# EAGLE schematic compact-sensor (EAGLE 9.5.2)
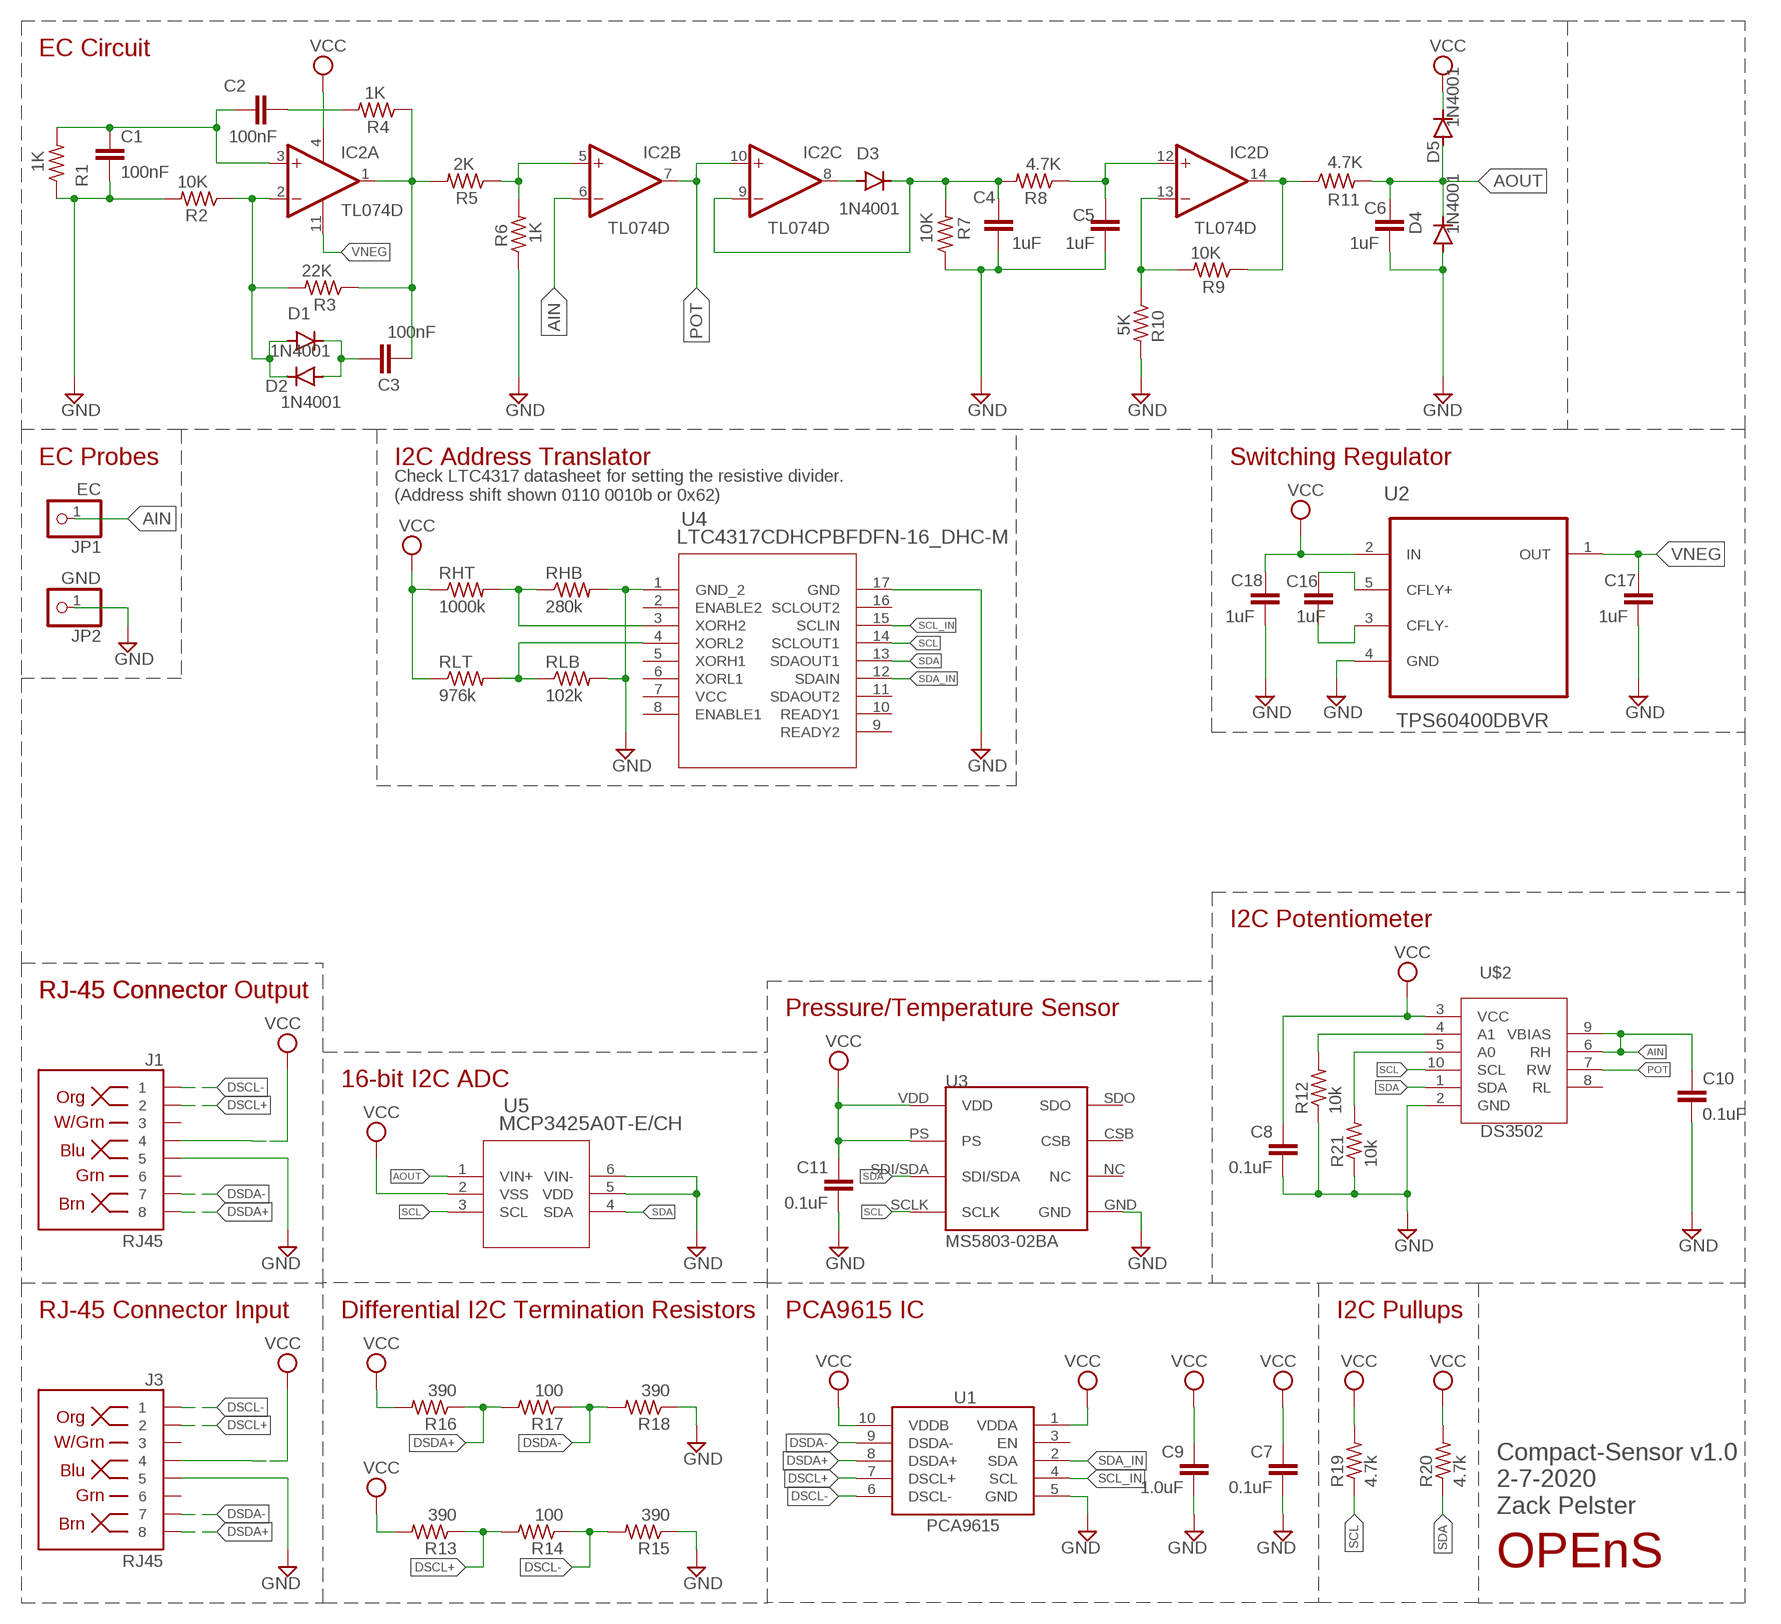
[diagram p0: schematic, sheet 1]

## Parts
C1  100nF  C-EUC0603  [C0603]
C2  100nF  C-EUC0603  [C0603]
C3  100nF  C-EUC0603  [C0603]
C4  1uF  C-EUC0603  [C0603]
C5  1uF  C-EUC0603  [C0603]
C6  1uF  C-EUC0603  [C0603]
C7  0.1uF  C-EUC0603  [C0603]
C8  0.1uF  C-EUC0603  [C0603]
C9  1.0uF  C-EUC0603  [C0603]
C10  0.1uF  C-EUC0603  [C0603]
C11  0.1uF  C-EUC0603  [C0603]
C16  1uF  C-EUC0603  [C0603]
C17  1uF  C-EUC0603  [C0603]
C18  1uF  C-EUC0603  [C0603]
D1  1N4001  DIODE-SOD123  [SOD123]
D2  1N4001  DIODE-SOD123  [SOD123]
D3  1N4001  DIODE-SOD123  [SOD123]
D4  1N4001  DIODE-SOD123  [SOD123]
D5  1N4001  DIODE-SOD123  [SOD123]
IC2  TL074D  [SO14]
J1  RJ45  RJ45-8  [RJ45-8]
J3  RJ45  RJ45-8  [RJ45-8]
JP1  EC  PINHD-1X1  [1X01]
JP2  GND  PINHD-1X1  [1X01]
R1  1K  R-US_R0603  [R0603]
R2  10K  R-US_R0603  [R0603]
R3  22K  R-US_R0603  [R0603]
R4  1K  R-US_R0603  [R0603]
R5  2K  R-US_R0603  [R0603]
R6  1K  R-US_R0603  [R0603]
R7  10K  R-US_R0603  [R0603]
R8  4.7K  R-US_R0603  [R0603]
R9  10K  R-US_R0603  [R0603]
R10  5K  R-US_R0603  [R0603]
R11  4.7K  R-US_R0603  [R0603]
R12  10k  R-US_R0603  [R0603]
R13  390  R-US_R0603  [R0603]
R14  100  R-US_R0603  [R0603]
R15  390  R-US_R0603  [R0603]
R16  390  R-US_R0603  [R0603]
R17  100  R-US_R0603  [R0603]
R18  390  R-US_R0603  [R0603]
R19  4.7k  R-US_R0603  [R0603]
R20  4.7k  R-US_R0603  [R0603]
R21  10k  R-US_R0603  [R0603]
RHB  280k  R-US_R0603  [R0603]
RHT  1000k  R-US_R0603  [R0603]
RLB  102k  R-US_R0603  [R0603]
RLT  976k  R-US_R0603  [R0603]
U1  PCA9615  [TSSOP10]
U2  TPS60400DBVR  [SOT95P280X145-5N]
U3  MS5803-02BA  [MS5803-02BA]
U4  LTC4317CDHCPBFDFN-16_DHC-M  [DFN-16_DHC-M]
U5  MCP3425A0T-E/CH  [SOT-23-6_MC]
U$1  OPENS-LOGO  [OPENS-LOGO]
U$2  DS3502  [MSOP10]

## Nets
AIN: C10.1 IC2.6(B:-IN) JP1.1 U$2.6(RH) U$2.9(VBIAS)
AOUT: C6.2 D4.C D5.A R11.2 U5.1(VIN+)
DSCL+: J1.2 J3.2 R13.1 R14.2 U1.7(DSCL+)
DSCL-: J1.1 J3.1 R14.1 R15.2 U1.6(DSCL-)
DSDA+: J1.8 J3.8 R16.1 R17.2 U1.8(DSDA+)
DSDA-: J1.7 J3.7 R17.1 R18.2 U1.9(DSDA-)
GND: C1.2 C4.1 C5.1 C6.1 C7.2 C8.2 C9.2 C10.2 C11.2 C17.1 C18.1 D4.A J1.5 J3.5 JP2.1 R1.1 R2.2 R6.1 R7.1 R10.2 R12.1 R15.1 R18.1 R21.1 RHB.2 RLB.2 U1.5(GND) U2.4(GND) U3.GND U4.1(GND_2) U4.17(GND) U5.5(VDD) U5.6(VIN-) U$2.2(GND)
N$1: C1.1 C2.1 IC2.3(A:+IN) R1.2
N$2: C2.2 R4.2
N$3: C3.2 IC2.1(A:OUT) R3.1 R4.1 R5.2
N$4: D1.A D2.C IC2.2(A:-IN) R2.1 R3.2
N$5: IC2.5(B:+IN) R5.1 R6.2
N$7: R12.2 U$2.4(A1)
N$8: R21.2 U$2.5(A0)
N$9: C3.1 D1.C D2.A
N$10: U5.2(VSS) ; supply symbol labelled VCC
N$11: RHB.1 RHT.2 U4.3(XORH2)
N$12: C4.2 D3.C IC2.9(C:-IN) R7.2 R8.2
N$13: D3.A IC2.8(C:OUT)
N$15: C5.2 IC2.12(D:+IN) R8.1
N$16: IC2.13(D:-IN) R9.2 R10.1
N$17: RLB.1 RLT.2 U4.4(XORL2)
N$18: IC2.14(D:OUT) R9.1 R11.1
N$27: C16.2 U2.5(CFLY+)
N$28: C16.1 U2.3(CFLY-)
POT: IC2.7(B:OUT) IC2.10(C:+IN) U$2.7(RW)
SCL: R19.1 U3.SCLK U4.14(SCLOUT1) U5.3(SCL) U$2.10(SCL)
SCL_IN: U1.4(SCL) U4.15(SCLIN)
SDA: R20.1 U3.SDI/SDA U4.13(SDAOUT1) U5.4(SDA) U$2.1(SDA)
SDA_IN: U1.2(SDA) U4.12(SDAIN)
VCC: C7.1 C8.1 C9.1 C11.1 C18.2 D5.C IC2.4(P:V+) J1.4 J3.4 R13.2 R16.2 R19.2 R20.2 RHT.1 RLT.1 U1.1(VDDA) U1.10(VDDB) U2.2(IN) U3.PS U3.VDD U$2.3(VCC)
VNEG: C17.2 IC2.11(P:V-) U2.1(OUT)
Unconnected: J1.3 J1.6 J3.3 J3.6 U1.3(EN) U3.CSB U3.NC U3.SDO U4.2(ENABLE2) U4.5(XORH1) U4.6(XORL1) U4.8(ENABLE1) U4.9(READY2) U4.10(READY1) U4.11(SDAOUT2) U4.16(SCLOUT2) U$2.8(RL)

## Notes on the sheet
- EC Circuit
- EC Probes | I2C Address Translator | Switching Regulator
- Check LTC4317 datasheet for setting the resistive divider.
  (Address shift shown 0110 0010b or 0x62)
- I2C Potentiometer
- RJ-45 Connector | RJ-45 Connector Output
- Pressure/Temperature Sensor
- 16-bit I2C ADC
- RJ-45 Connector Input | Differential I2C Termination Resistors | PCA9615 IC | I2C Pullups
- Compact-Sensor v1.0
  2-7-2020
  Zack Pelster

## Power pins joined to a net without a drawn wire
VCC: U4.7(VCC)

## Library data of the parts
C1-C11 C16-C18 = rcl:C-EU: CAPACITOR, European symbol; SPICEPREFIX: C
D1-D5 = diode:DIODE-: DIODE
IC2 = linear:TL074: OP AMP
J1 J3 = SparkFun-Connectors:RJ45-8: RJ45 Jack - 8 pin Simple RJ45, 8-pin connection. Commonly used for Cat5, Cat5e, and Cat6 Ethernet cables. Here is the connector we sell at SparkFun: RJ45 8-Pin Connector <https://www.sparkfun.com/products/643> (PRT-00643) Datasheet <https://cdn.sparkfun.com/datasheets/Prototyping/04908.pdf> It is used on this SparkFun product: SparkFun RJ45 Breakout <https://www.sparkfun.com/products/716> (BOB-00716) Note, you may also be interested in the "MAGJACK" version of this. It is basically a RJ45 connector, but also has some status LEDs built into the connector housing. You can check that out in this library at the device named "MAGJACK.dev" and see these products online: RJ45 Ethernet MagJack-Compatible <https://www.sparkfun.com/products/8534> (PRT-08534) SparkFun RJ45 MagJack Breakout <https://www.sparkfun.com/products/13021> (BOB-13021); PROD_ID: CONN-08506; SF_ID: PRT-00643
JP1 JP2 = pinhead_simple:PINHD-1X1: PIN HEADER
R1-R21 RHB RHT RLB RLT = rcl:R-US_: RESISTOR, American symbol; SPICEPREFIX: R
U1 = SparkFun-IC-Comms:PCA9615: Differential I2C Bus Buffer Datasheet <https://www.nxp.com/docs/en/data-sheet/PCA9615.pdf>; PROD_ID: IC-13899
U2 = TPS60400DBVR:TPS60400DBVR: Unregulated 60mA charge pump Voltage Inverter; AVAILABILITY: Unavailable; DESCRIPTION: 60mA Charge Pump Voltage Inverter with Variable Switching Frequency 5-SOT-23 -40 to 85; MF: Texas Instruments; MP: TPS60400DBVR; PACKAGE: SOT-23-5 Texas Instruments; PRICE: None
U3 = PNNL_Probe:MS5803-02BA
U4 = PNNL_Probe:LTC4317CDHCPBF; BUILT_BY: EMA_UL_Team; MANUFACTURER_PART_NUMBER: LTC4317CDHC#PBF; VENDOR: Linear Technology
U5 = PNNL_Probe:MCP3425A0T-E/CH; BUILT_BY: EMA_UL_Team; MANUFACTURER_PART_NUMBER: MCP3425A0T-E/CH; VENDOR: Microchip
U$1 = opens-logo:OPENS-LOGO: OPENS Lab Logo
U$2 = microbuilder:DS3502

## Net classes
0 default: width 0.305 mm